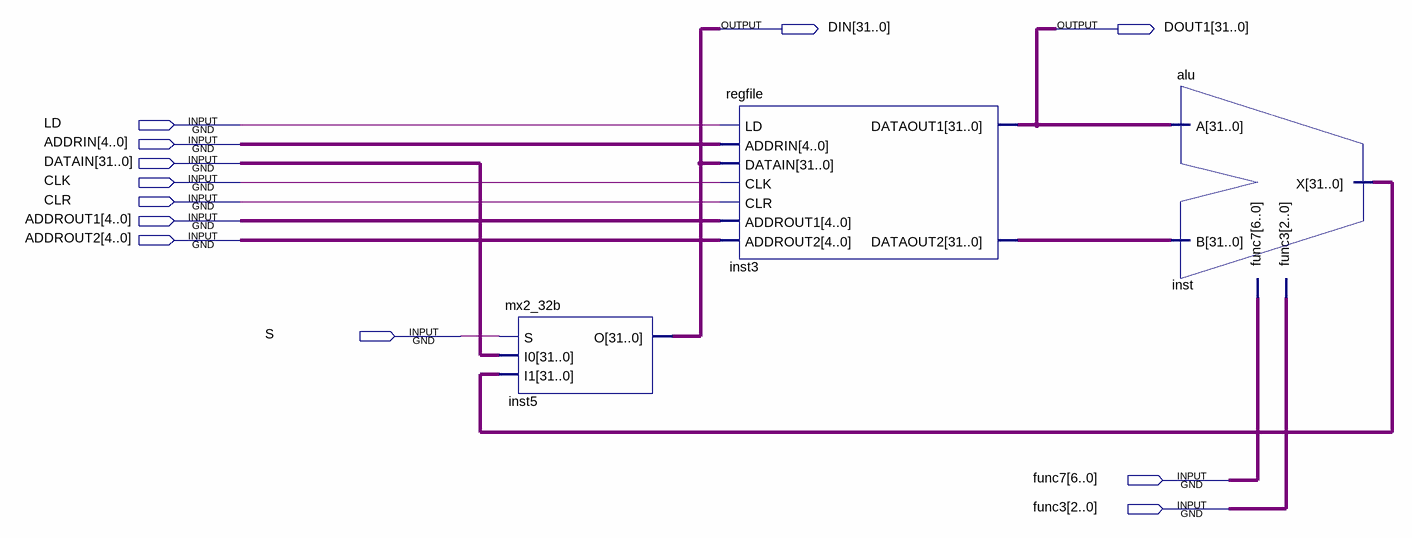
[diagram p0: schematic sheet]
// Quartus schematic cpu_test.bdf as structural Verilog: 3 symbols, 12 pins
module cpu_test (
  input  LD,
  input  [4:0] ADDRIN,
  input  [31:0] DATAIN,
  input  CLK,
  input  CLR,
  input  [4:0] ADDROUT1,
  input  [4:0] ADDROUT2,
  input  S,
  input  [6:0] func7,
  input  [2:0] func3,
  output [31:0] DIN,
  output [31:0] DOUT1
);

  wire [31:0] inst3_dataout2, inst_x;

  mx2_32b inst5 (.S(S), .I0(DATAIN), .I1(inst_x), .O(DIN));
  regfile inst3 (
    .LD(LD), .ADDRIN(ADDRIN), .DATAIN(DIN), .CLK(CLK), .CLR(CLR), .ADDROUT1(ADDROUT1), .ADDROUT2(ADDROUT2),
    .DATAOUT2(inst3_dataout2), .DATAOUT1(DOUT1));
  alu inst (.func3(func3), .A(DOUT1), .B(inst3_dataout2), .func7(func7), .X(inst_x));
endmodule
